# EAGLE design BMS_Schematic (EAGLE 9.7.0)
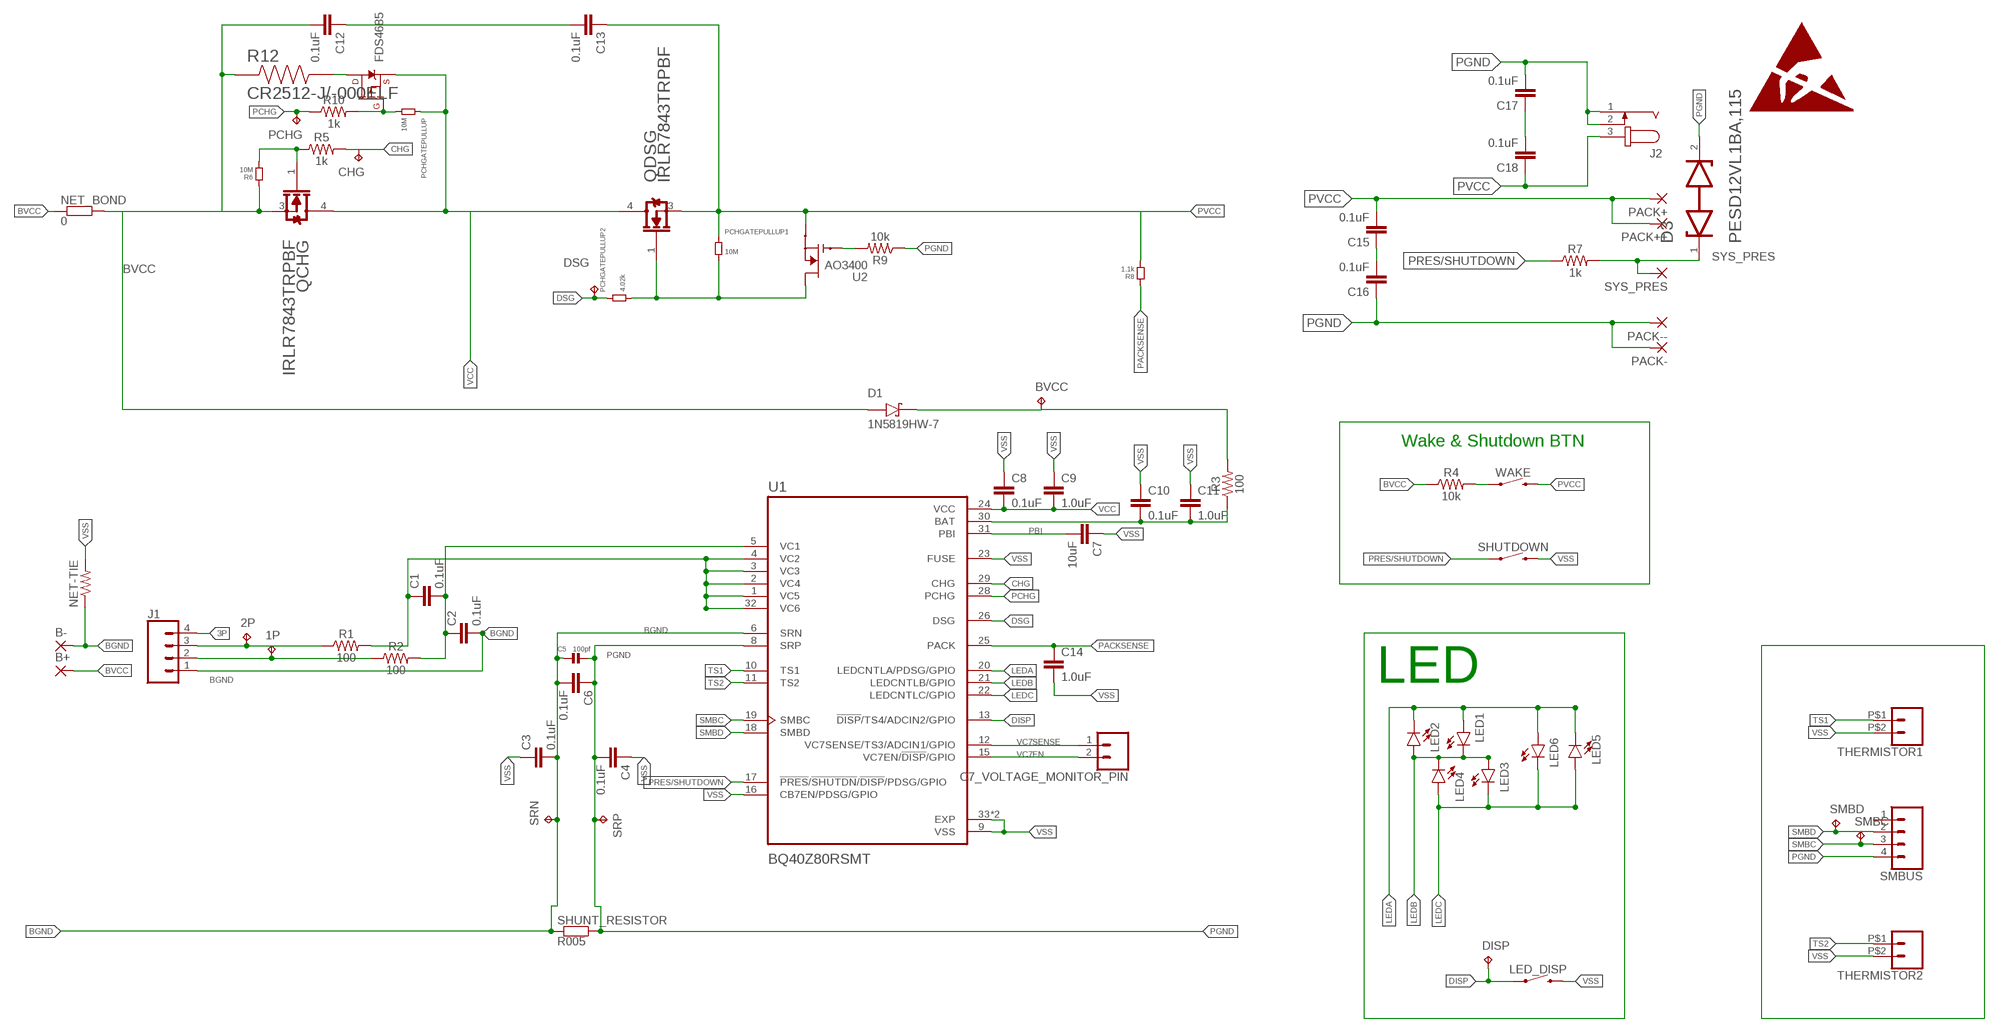
[diagram p0: schematic, sheet 1]

## Parts
1P  TPTP10R  [TP10R]
2P  TPTP10R  [TP10R]
B+  WIREPADSMD5-2,5  [5-2,5]
B-  WIREPADSMD5-2,5  [5-2,5]
BVCC  TPTP10R  [TP10R]
C1  0.1uF  0.1UF-0603-25V-5%  [0603]
C2  0.1uF  0.1UF-0603-25V-5%  [0603]
C3  0.1uF  0.1UF-0603-25V-5%  [0603]
C4  0.1uF  0.1UF-0603-25V-5%  [0603]
C5  100pf  CAPACITOR.0805  [0805]
C6  0.1uF  0.1UF-0603-25V-5%  [0603]
C7  10uF  10UF-0603-6.3V-20%  [0603]
C7_VOLTAGE_MONITOR_PIN  CONN_02  [1X02]
C8  0.1uF  0.1UF-0603-25V-(+80/-20%)  [0603]
C9  1.0uF  1.0UF-0603-16V-10%-X7R  [0603]
C10  0.1uF  0.1UF-0603-25V-(+80/-20%)  [0603]
C11  1.0uF  1.0UF-0603-16V-10%-X7R  [0603]
C12  0.1uF  0.1UF-0603-25V-(+80/-20%)  [0603]
C13  0.1uF  0.1UF-0603-25V-(+80/-20%)  [0603]
C14  1.0uF  1.0UF-0603-16V-10%-X7R  [0603]
C15  0.1uF  0.1UF-0603-25V-(+80/-20%)  [0603]
C16  0.1uF  0.1UF-0603-25V-(+80/-20%)  [0603]
C17  0.1uF  0.1UF-0603-25V-(+80/-20%)  [0603]
C18  0.1uF  0.1UF-0603-25V-(+80/-20%)  [0603]
CHG  TPTP10R  [TP10R]
D1  1N5819HW-7  [SOD3715X145N]
D3  NEXPERIA_PESD12VL1BA,115NEXPERIA_PESD12VL1BA,115_0_0  [NEXPERIA_PESD12VL1BA,115_0]
DISP  TPTP10R  [TP10R]
DSG  TPTP10R  [TP10R]
J1  CONN_04JST-PTH  [JST-4-PTH]
J2  JACK-PLUG0  [SPC4077]
LED1  GREEN  LED-GREEN0603  [LED-0603]
LED2  GREEN  LED-GREEN0603  [LED-0603]
LED3  GREEN  LED-GREEN0603  [LED-0603]
LED4  GREEN  LED-GREEN0603  [LED-0603]
LED5  GREEN  LED-GREEN0603  [LED-0603]
LED6  GREEN  LED-GREEN0603  [LED-0603]
LED_DISP  MOMENTARY-SWITCH-SPST-SMD-6.0X3.5MM  [TACTILE_SWITCH_SMD_6.0X3.5MM]
NET-TIE  0  0OHM-0402T-1/10W  [0402-TIGHT]
NET_BOND  0  BVS  [BVS]
PACK+  WIREPADSMD5-2,5  [5-2,5]
PACK++  WIREPADSMD5-2,5  [5-2,5]
PACK-  WIREPADSMD5-2,5  [5-2,5]
PACK--  WIREPADSMD5-2,5  [5-2,5]
PCHG  TPTP10R  [TP10R]
PCHGATEPULLUP  10M  RESISTOR.0805  [0805]
PCHGATEPULLUP1  10M  RESISTOR.0805  [0805]
PCHGATEPULLUP2  4.02k  RESISTOR.0805  [0805]
QCHG  INFINEON_IRLR7843TRPBFINFINEON_IRLR7843TRPBF_0_0  [INFINEON_IRLR7843TRPBF_0]
QDSG  INFINEON_IRLR7843TRPBFINFINEON_IRLR7843TRPBF_0_0  [INFINEON_IRLR7843TRPBF_0]
R1  100  100OHM-0603-1/10W-1%  [0603]
R2  100  100OHM-0603-1/10W-1%  [0603]
R3  100  100OHM-0603-1/10W-1%  [0603]
R4  10k  10KOHM-0603-1/10W-1%  [0603]
R5  1k  1KOHM-0603-1/10W-1%  [0603]
R6  10M  RESISTOR.0805  [0805]
R7  1k  1KOHM-0603-1/10W-1%  [0603]
R8  1.1k  RESISTOR.0805  [0805]
R9  10k  10KOHM-0603-1/10W-1%  [0603]
R10  1k  1KOHM-0603-1/10W-1%  [0603]
R12  CR2512-J/-000ELF  [RESC6331X75N]
SHUNT_RESISTOR  R005  BVS  [BVS]
SHUTDOWN  MOMENTARY-SWITCH-SPST-SMD-6.0X3.5MM  [TACTILE_SWITCH_SMD_6.0X3.5MM]
SMBC  TPTP10R  [TP10R]
SMBD  TPTP10R  [TP10R]
SMBUS  CONN_04JST-SMD-LOCKING  [JST-4-SMD-1.25MM-LOCKING]
SRN  TPTP10R  [TP10R]
SRP  TPTP10R  [TP10R]
SYS_PRES  SMD2  [SMD1,27-2,54]
THERMISTOR1  SOLDER_PAD_2  [SOLDER_PAD_2]
THERMISTOR2  SOLDER_PAD_2  [SOLDER_PAD_2]
U1  BQ40Z80RSMT  [QFN40P400X400X100-33N]
U2  AO3400  [SOT23]
U$2  FDS4685  [SOIC127P600X150-8N]
WAKE  MOMENTARY-SWITCH-SPST-SMD-6.0X3.5MM  [TACTILE_SWITCH_SMD_6.0X3.5MM]

## Nets
1P: C1.2 C2.1 R2.2 U1.5(VC1)
2P: C1.1 R1.2 U1.1(VC5) U1.2(VC4) U1.3(VC3) U1.4(VC2) U1.32(VC6)
3P: J1.4
BAT: C10.2 C11.2 R3.1 U1.30(BAT)
BGND: B-.1(P) C2.2 C3.2 C5.1 C6.2 J1.1 NET-TIE.1 SHUNT_RESISTOR.2 SRN.TP U1.6(SRN)
BVCC: B+.1(P) C12.2 D1.A NET_BOND.1 NET_BOND.2 QCHG.3(SOURCE) R4.1 R6.1 R12.1
CHG: CHG.TP R5.2 U1.29(CHG)
DISP: DISP.TP LED_DISP.1 U1.13(!DISP!/TS4/ADCIN2/GPIO)
DSG: DSG.TP PCHGATEPULLUP2.1 U1.26(DSG)
LEDA: LED1.A LED2.C LED5.C LED6.A U1.20(LEDCNTLA/PDSG/GPIO)
LEDB: LED1.C LED2.A LED3.A LED4.C U1.21(LEDCNTLB/GPIO)
LEDC: LED3.C LED4.A LED5.A LED6.C U1.22(LEDCNTLC/GPIO)
N$3: R9.2 U2.1(G)
N$4: 2P.TP J1.3 R1.1
N$5: 1P.TP J1.2 R2.1
N$6: C12.1 C13.2
N$7: BVCC.TP D1.C(K) R3.2
N$8: R12.2 U$2.5(D) U$2.6(D) U$2.7(D) U$2.8(D)
N$9: PCHGATEPULLUP.2 R10.2 U$2.4(G)
N$10: QCHG.1(GATE) R5.1 R6.2
N$11: PCHGATEPULLUP1.2 PCHGATEPULLUP2.2 QDSG.1(GATE) U2.3(D)
N$13: R4.2 WAKE.1
N$14: C15.1 C16.2
N$18: C17.1 C18.2
PACKSENSE: C14.1 R8.1 U1.25(PACK)
PBI: C7.2 U1.31(PBI)
PCHG: PCHG.TP R10.1 U1.28(PCHG)
PGND: C4.2 C5.2 C6.1 C16.1 C17.2 D3.2(CATHODE_2) J2.1 J2.2 PACK--.1(P) PACK-.1(P) R9.1 SHUNT_RESISTOR.1 SMBUS.4 SRP.TP U1.8(SRP)
PRES/SHUTDOWN: R7.1 SHUTDOWN.1 U1.17(!PRES!/!SHUTDN!/!DISP!/PDSG/GPIO)
PVCC: C13.1 C15.2 C18.1 J2.3 PACK++.1(P) PACK+.1(P) PCHGATEPULLUP1.1 QDSG.3(SOURCE) R8.2 U2.2(S) WAKE.2
SMBC: SMBC.TP SMBUS.3 U1.19(SMBC)
SMBD: SMBD.TP SMBUS.2 U1.18(SMBD)
SYS_PRES: D3.1(CATHODE_1) R7.2 SYS_PRES.1(P)
TS1: THERMISTOR1.P$1 U1.10(TS1)
TS2: THERMISTOR2.P$1 U1.11(TS2)
VC7EN: C7_VOLTAGE_MONITOR_PIN.2 U1.15(VC7EN/!DISP!/GPIO)
VC7SENSE: C7_VOLTAGE_MONITOR_PIN.1 U1.12(VC7SENSE/TS3/ADCIN1/GPIO)
VCC: C8.2 C9.2 PCHGATEPULLUP.1 QCHG.4(DRAIN) QDSG.4(DRAIN) U1.24(VCC) U$2.1(S) U$2.2(S) U$2.3(S)
VSS: C3.1 C4.1 C7.1 C8.1 C9.1 C10.1 C11.1 C14.2 LED_DISP.2 NET-TIE.2 SHUTDOWN.2 THERMISTOR1.P$2 THERMISTOR2.P$2 U1.9(VSS) U1.16(CB7EN/PDSG/GPIO) U1.23(FUSE) U1.33(EXP) U1.33_1(EXP)
Unconnected: SMBUS.1

## Notes on the sheet
- Wake & Shutdown BTN
- LED

## Library data of the parts
1P 2P BVCC CHG DISP DSG PCHG SMBC SMBD SRN SRP = testpad:TP: Test pad
B+ B- PACK+ PACK++ PACK- PACK-- = wirepad:WIREPAD: Wire PAD connect wire on PCB
C1-C4 C6 = SparkFun-Capacitors:0.1UF: 0.1µF ceramic capacitors A capacitor is a passive two-terminal electrical component used to store electrical energy temporarily in an electric field.; PROD_ID: CAP-08604
C5 = standardparts:CAPACITOR
C7 = SparkFun-Capacitors:10UF: 10.0µF ceramic capacitors A capacitor is a passive two-terminal electrical component used to store electrical energy temporarily in an electric field.; PROD_ID: CAP-11015
C7_VOLTAGE_MONITOR_PIN = SparkFun-Connectors:CONN_02: Multi connection point. Often used as Generic Header-pin footprint for 0.1 inch spaced/style header connections On any of the 0.1 inch spaced packages, you can populate with these: Break Away Headers - Straight <https://www.sparkfun.com/products/116> (PRT-00116) Break Away Male Headers - Right Angle <https://www.sparkfun.com/products/553> (PRT-00553) Female Headers <https://www.sparkfun.com/products/115> (PRT-00115) Break Away Headers - Machine Pin <https://www.sparkfun.com/products/117> (PRT-00117) Break Away Female Headers - Swiss Machine Pin <https://www.sparkfun.com/products/743> (PRT-00743) For SCREWTERMINALS and SPRING TERMINALS visit here: Screw Terimnals on SparkFun.com <https://www.sparkfun.com/search/results?term=Screw+Terminals> (5mm/3.5mm/2.54mm spacing) This device is also useful as a general connection point to wire up your design to another part of your project. Our various solder wires solder well into these plated through hole pads. Hook-Up Wire - Assortment (Stranded, 22 AWG) <https://www.sparkfun.com/products/11375> (PRT-11375) Hook-Up Wire - Assortment (Solid Core, 22 AWG) <https://www.sparkfun.com/products/11367> (PRT-11367) View the entire wire category on our website here <https://www.sparkfun.com/categories/141> Special notes: Molex polarized connector foot print use with: PRT-08233 with associated crimp pins and housings. 2.54_SCREWTERM for use with PRT-10571. 3.5mm Screw Terminal footprints for PRT-08084 5mm Screw Terminal footprints for use with PRT-08432
C8 C10 C12 C13 C15-C18 = SparkFun-Capacitors:0.1UF: 0.1µF ceramic capacitors A capacitor is a passive two-terminal electrical component used to store electrical energy temporarily in an electric field.; PROD_ID: CAP-00810
C9 C11 C14 = SparkFun-Capacitors:1.0UF: 1µF ceramic capacitors A capacitor is a passive two-terminal electrical component used to store electrical energy temporarily in an electric field.; PROD_ID: CAP-13930
D1 = 1N5819HW-7.lbr.lbr:1N5819HW-7: 1N5819HW Series 40 V 1 A Surface Mount Schottky Barrier Rectifier - SOD-123 Check availability <https://pricing.snapeda.com/parts/1N5819HW-7/Diodes%20Inc./view-part?ref=eda>; AVAILABILITY: In Stock; DESCRIPTION: Diode Schottky 40 V 1A Surface Mount SOD-123; MF: Diodes Inc.; MP: 1N5819HW-7; PACKAGE: SOD-123 Fairchild Semiconductor; PRICE: None; PURCHASE-URL: https://pricing.snapeda.com/search/part/1N5819HW-7/?ref=eda
D3 = Nexperia - PESD12VL1BA,115:NEXPERIA_PESD12VL1BA,115: Low capacitance bidirectional ESD protection diodes in SOD323; AMBIENT_TEMPERATURE_RANGE_HIGH: +150°C; AMBIENT_TEMPERATURE_RANGE_LOW: -65°C; BREAKDOWN_VOLTAGE: 15.9V; CENTROID_NOT_SPECIFIED: No; CLAMPING_VOLTAGE: 37V; DATASHEET: https://assets.nexperia.com/documents/data-sheet/PESDXL1BA_SER.pdf; DEVICE_CLASS_L1: Circuit Protection; DEVICE_CLASS_L2: TVS Diodes; DEVICE_CLASS_L3: unset; DIGIKEY_DESCRIPTION: DIODE TVS DIODE 12V 37V SOD323; DIGIKEY_PART_NUMBER: 1727-3808-1-ND; FOOTPRINT_URL: https://assets.nexperia.com/documents/outline-drawing/SOD323.pdf; HEIGHT: 1.1mm; LEAD_FREE: yes; MAX_JUNCTION_TEMP: +150°C; MF: Nexperia; MFG_PACKAGE_IDENT: SOD323; MFG_PACKAGE_IDENT_DATE: 04/2018; MFG_PACKAGE_IDENT_REV: 0; MOUSER_DESCRIPTION: PESDxL1BA series - Low capacitance bidirectional ESD protection diodes in SOD323; MOUSER_PART_NUMBER: 771-PESD12VL1BA-T/R; MPN: PESD12VL1BA,115; PACKAGE: SOD323; PEAK_PULSE_CURRENT: 5A; PREFIX: D; REVERSE_STANDOFF_VOLTAGE: 12V; ROHS: yes; STANDOFF_HEIGHT: 0mm; VERIFICATION_VERSION: 0.0.0.1
J1 = SparkFun-Connectors:CONN_04: Multi connection point. Often used as Generic Header-pin footprint for 0.1 inch spaced/style header connections On any of the 0.1 inch spaced packages, you can populate with these: Break Away Headers - Straight <https://www.sparkfun.com/products/116> (PRT-00116) Break Away Male Headers - Right Angle <https://www.sparkfun.com/products/553> (PRT-00553) Female Headers <https://www.sparkfun.com/products/115> (PRT-00115) Break Away Headers - Machine Pin <https://www.sparkfun.com/products/117> (PRT-00117) Break Away Female Headers - Swiss Machine Pin <https://www.sparkfun.com/products/743> (PRT-00743) For SCREWTERMINALS and SPRING TERMINALS visit here: Screw Terimnals on SparkFun.com <https://www.sparkfun.com/search/results?term=Screw+Terminals> (5mm/3.5mm/2.54mm spacing) This device is also useful as a general connection point to wire up your design to another part of your project. Our various solder wires solder well into these plated through hole pads. Hook-Up Wire - Assortment (Stranded, 22 AWG) <https://www.sparkfun.com/products/11375> (PRT-11375) Hook-Up Wire - Assortment (Solid Core, 22 AWG) <https://www.sparkfun.com/products/11367> (PRT-11367) View the entire wire category on our website here <https://www.sparkfun.com/categories/141> Special notes: Molex polarized connector foot print use with SKU : PRT-08231 with associated crimp pins and housings. 1MM SMD Version SKU: PRT-10208; PROD_ID: WIRE-13531; SF_ID: PRT-09916
J2 = con-jack:JACK-PLUG: DC POWER JACK Power Jack, DC, Right Angle, Through Hole, Rated 5A at 16VDC, PC Terminals Distributor: Farnell (www.Farnell.de) Drawing: 84N1161.pdf / 84N1162.pdf Manufacturer: SPC Technology (www.spctechnology.com) Type: SPC4077 / SPC 4078; OC_FARNELL: unknown; OC_NEWARK: unknown
LED1-LED6 = SparkFun-LED:LED-GREEN: Green SMD LED Used in manufacturing of various products at SparkFun Packages: 0603 - SMD 0603 package [Product Link] <http://www.futureelectronics.com/en/technologies/semiconductors/optoelectronics/leds/Pages/9894312-LTST-C190GKT.aspx?CrossPart=HSMG-C190&IM=0> LilyPad 1206 - SMD1206 LilyPad package [Product Link] <http://www.futureelectronics.com/en/Technologies/Product.aspx?ProductID=IN150NGHARVATEKCORPORATION2049943&IM=0> 1206 - SMD1206 package [Product Link] <http://www.futureelectronics.com/en/technologies/semiconductors/optoelectronics/leds/Pages/8315665-LTST-C150KGKT.aspx?IM=0> 1206 Bottom Mount -SMD 1206 Bottom Mount [Product Link] <http://www.digikey.com/product-detail/en/lite-on-inc/LTST-C230KGKT/160-1456-1-ND/386854> SparkFun Products: Pro Mini 328 -5V <https://www.sparkfun.com/products/821> RedBoard <https://www.sparkfun.com/products/12757> MP3 Trigger <https://www.sparkfun.com/products/13720> Makey Makey <https://www.sparkfun.com/products/11076>; PROD_ID: DIO-00821
LED_DISP SHUTDOWN WAKE = SparkFun-Switches:MOMENTARY-SWITCH-SPST: Momentary Switch (Pushbutton) - SPST Normally-open (NO) SPST momentary switches (buttons, pushbuttons). Variants PTH-12MM - 12mm square, through-hole Momentary Pushbutton Switch - 12mm Square <https://www.sparkfun.com/products/9190> (COM-09190) PTH-6.0MM, PTH-6.0MM-KIT - 6.0mm square, through-hole Mini Pushbutton Switch <https://www.sparkfun.com/products/97> (COM-00097) KIT package intended for soldering kit's - only one side of pads' copper is exposed. PTH-RIGHT-ANGLE-KIT - Right-angle, through-hole Right Angle Tactile Button <https://www.sparkfun.com/products/10791> - Used on SparkFun BigTime Watch Kit <https://www.sparkfun.com/products/11734> SMD-12MM - 12mm square, surface-mount Tactile Button - SMD (12mm) <https://www.sparkfun.com/products/12993> (COM-12993) Used on SparkFun PicoBoard <https://www.sparkfun.com/products/11888> SMD-4.5MM - 4.5mm Square Trackball Switch Used on SparkFun Blackberry Trackballer Breakout <https://www.sparkfun.com/products/13169> SMD-4.6MMX2.8MM - 4.60mm x 2.80mm, surface mount Used on SparkFun Pro Micro - RP2040 <https://www.sparkfun.com/products/17717> SMD-5.2MM, SMD-5.2-REDUNDANT - 5.2mm square, surface-mount Mini Pushbutton Switch - SMD <https://www.sparkfun.com/products/8720> (COM-08720) Used on Arduino Pro Mini <https://www.sparkfun.com/products/11114> REDUNDANT package connects both switch circuits together SMD-6.0X3.5MM - 6.0 x 3.5mm, surface mount Momentary Reset Switch SMD <https://www.sparkfun.com/products/8229> (COM-08229) SMD-6.2MM-TALL - 6.2mm square, surface mount Tactile Button - SMD (6mm) <https://www.sparkfun.com/products/12992> Used on SparkFun Digital Sandbox <https://www.sparkfun.com/products/12651> SMD-RIGHT-ANGLE - Right-angle, surface mount Used on SparkFun Block for Intel® Edison - Arduino <https://www.sparkfun.com/products/13036>; PROD_ID: SWCH-14278; SF_SKU: COM-08229
NET-TIE = SparkFun-Resistors:0OHM: 0Ω resistor A resistor is a passive two-terminal electrical component that implements electrical resistance as a circuit element. Resistors act to reduce current flow, and, at the same time, act to lower voltage levels within circuits. - Wikipedia; PROD_ID: RES-14244
NET_BOND SHUNT_RESISTOR = resistor-shunt.lbr.lbr:BVS: SMD SHUNT RESISTOR; OC_FARNELL: unknown; OC_NEWARK: unknown
PCHGATEPULLUP PCHGATEPULLUP1 PCHGATEPULLUP2 R6 R8 = standardparts:RESISTOR
QCHG QDSG = Infineon - IRLR7843TRPBF:INFINEON_IRLR7843TRPBF: N-Channel 30V 161A (Tc) 140W (Tc) Surface Mount D-Pak; AUTOMOTIVE: No; CENTROID_NOT_SPECIFIED: Yes; CONTINUOUS_DRAIN_CURRENT: 161A; DATASHEET: https://www.infineon.com/dgdl/irlr7843pbf.pdf?fileId=5546d462533600a40153566de53526d8; DEPLETION_MODE: False; DEVICE_CLASS_L1: Discrete Semiconductors; DEVICE_CLASS_L2: Transistors; DEVICE_CLASS_L3: MOSFETs; DIGIKEY_DESCRIPTION: MOSFET N-CH 30V 161A DPAK; DIGIKEY_PART_NUMBER: IRLR7843PBFCT-ND; DRAIN_TO_SOURCE_BREAKDOWN_VOLTAGE: 30V; DRAIN_TO_SOURCE_RESISTANCE: 3.2mΩ; DRAIN_TO_SOURCE_VOLTAGE: 30V; FOOTPRINT_URL: https://www.infineon.com/cms/en/product/packages/PG-TO252/PG-TO252-3-901/; FOOTPRINT_VARIANT_NAME_0: Recommended_Land_Pattern; GATE_CHARGE_AT_VGS: 34nC @ 4.5V; GATE_TO_SOURCE_VOLTAGE: 20V; HEIGHT: 2.52mm; INPUT_CAPACITACE_AT_VDS: 4380pF @ 15V; LEAD_FREE: Yes; MAX_FORWARD_DIODE_VOLTAGE: 1V; MAX_JUNCTION_TEMP: +175°C; MF: Infineon; MFG_PACKAGE_IDENT: PG-TO252-3; MFG_PACKAGE_IDENT_COMPONENT_ID: d9d1000c4571b64f; MFG_PACKAGE_IDENT_DATE: 0; MFG_PACKAGE_IDENT_REV: 901; MOUSER_PART_NUMBER: 942-IRLR7843TRPBF; MPN: IRLR7843TRPBF; NUMBER_OF_CHANNELS: 1; NUMBER_OF_N_CHANNELS: 1; PACKAGE: TO252-3; POWER_DISSIPATION: 140W; PREFIX: Q; PULSE_DRAIN_CURRENT: 620A; REVERSE_RECOVERY_CHARGE: 36nC; REVERSE_RECOVERY_TIME: 39ns; ROHS: Yes; RTHJA_MAX: 50°C/W; TEMPERATURE_RANGE_HIGH: +175°C; TEMPERATURE_RANGE_LOW: -55°C; THRESHOLD_VGS_MAX: 2.3V; THRESHOLD_VGS_MIN: 1.4V; TURN_OFF_DELAY_TIME: 34ns; TURN_ON_DELAY_TIME: 25ns; VERIFICATION_VERSION: 0.0.0.3
R1-R3 = SparkFun-Resistors:100OHM: 100Ω resistor A resistor is a passive two-terminal electrical component that implements electrical resistance as a circuit element. Resistors act to reduce current flow, and, at the same time, act to lower voltage levels within circuits. - Wikipedia; PROD_ID: RES-07863
R4 R9 = SparkFun-Resistors:10KOHM: 10kΩ resistor A resistor is a passive two-terminal electrical component that implements electrical resistance as a circuit element. Resistors act to reduce current flow, and, at the same time, act to lower voltage levels within circuits. - Wikipedia; PROD_ID: RES-00824
R5 R7 R10 = SparkFun-Resistors:1KOHM: 1kΩ resistor A resistor is a passive two-terminal electrical component that implements electrical resistance as a circuit element. Resistors act to reduce current flow, and, at the same time, act to lower voltage levels within circuits. - Wikipedia; PROD_ID: RES-07856
R12 = CR2512-J_-000ELF.lbr.lbr:CR2512-J/-000ELF: RES, THICK FILM, 0R, 5%, 1W, 2512 Check availability <https://pricing.snapeda.com/parts/CR2512-J/-000ELF/Bourns/view-part?ref=eda>; AVAILABILITY: In Stock; DESCRIPTION: 0 Ohms Jumper 1W Chip Resistor 2512 (6432 Metric) - Thick Film; MF: Bourns; MP: CR2512-J/-000ELF; PACKAGE: 6331 Bourns; PRICE: None; PURCHASE-URL: https://pricing.snapeda.com/search?q=CR2512-J/-000ELF&ref=eda
SMBUS = SparkFun-Connectors:CONN_04: Multi connection point. Often used as Generic Header-pin footprint for 0.1 inch spaced/style header connections On any of the 0.1 inch spaced packages, you can populate with these: Break Away Headers - Straight <https://www.sparkfun.com/products/116> (PRT-00116) Break Away Male Headers - Right Angle <https://www.sparkfun.com/products/553> (PRT-00553) Female Headers <https://www.sparkfun.com/products/115> (PRT-00115) Break Away Headers - Machine Pin <https://www.sparkfun.com/products/117> (PRT-00117) Break Away Female Headers - Swiss Machine Pin <https://www.sparkfun.com/products/743> (PRT-00743) For SCREWTERMINALS and SPRING TERMINALS visit here: Screw Terimnals on SparkFun.com <https://www.sparkfun.com/search/results?term=Screw+Terminals> (5mm/3.5mm/2.54mm spacing) This device is also useful as a general connection point to wire up your design to another part of your project. Our various solder wires solder well into these plated through hole pads. Hook-Up Wire - Assortment (Stranded, 22 AWG) <https://www.sparkfun.com/products/11375> (PRT-11375) Hook-Up Wire - Assortment (Solid Core, 22 AWG) <https://www.sparkfun.com/products/11367> (PRT-11367) View the entire wire category on our website here <https://www.sparkfun.com/categories/141> Special notes: Molex polarized connector foot print use with SKU : PRT-08231 with associated crimp pins and housings. 1MM SMD Version SKU: PRT-10208; PROD_ID: CONN-15303
SYS_PRES = wirepad:SMD2: SMD PAD
THERMISTOR1 THERMISTOR2 = SparkFun-Connectors:SOLDER_PAD_2: Solder Pad for LuMini Rings
U1 = BQ40Z80:BQ40Z80RSMT: 2-Series to 7-Series Battery Pack Manager with Impedance Track Gas Gauging 32-VQFN -40 to 85 Check availability <https://pricing.snapeda.com/parts/BQ40Z80RSMT/Texas%20Instruments/view-part?ref=eda>; AVAILABILITY: In Stock; DESCRIPTION: 2-s to 6-s battery pack manager with Impedance Track&trade; gas gauging; MF: Texas Instruments; MP: BQ40Z80RSMT; PACKAGE: VQFN-32 Texas Instruments; PRICE: None; PURCHASE-URL: https://pricing.snapeda.com/search/part/BQ40Z80RSMT/?ref=eda
U2 = AO3400.lbr.lbr:AO3400: Check availability <https://pricing.snapeda.com/parts/AO3400/Alpha%20%26/view-part?ref=eda>; AVAILABILITY: In Stock; DESCRIPTION: N-Channel 30 V 5.8A (Ta) 1.4W (Ta) Surface Mount SOT-23-3; MF: Alpha &; MP: AO3400; PACKAGE: SOT-23-3 Alpha &amp; Omega Semiconductor; PRICE: None; PURCHASE-URL: https://pricing.snapeda.com/search/part/AO3400/?ref=eda
U$2 = FDS4685:FDS4685

## Board
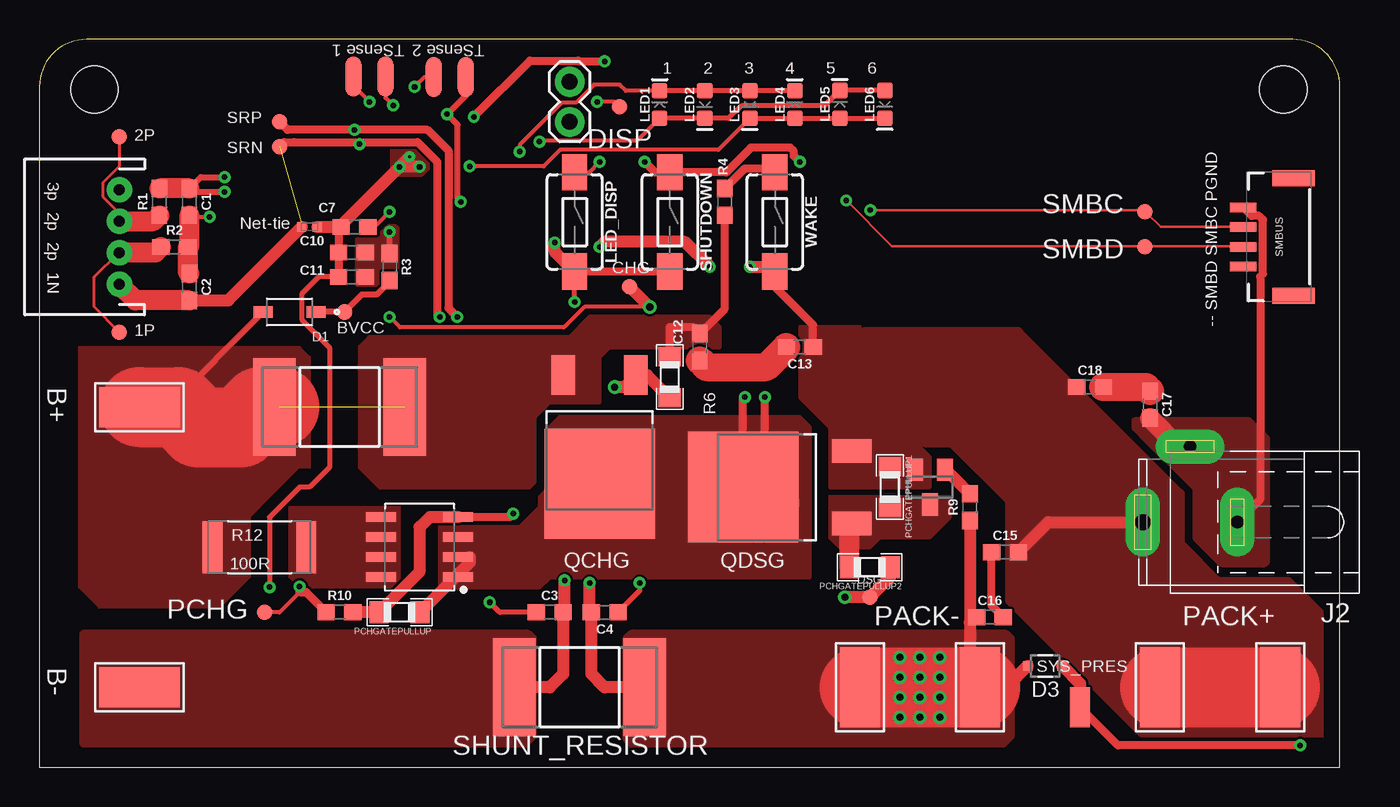
[diagram p1: board, top side]
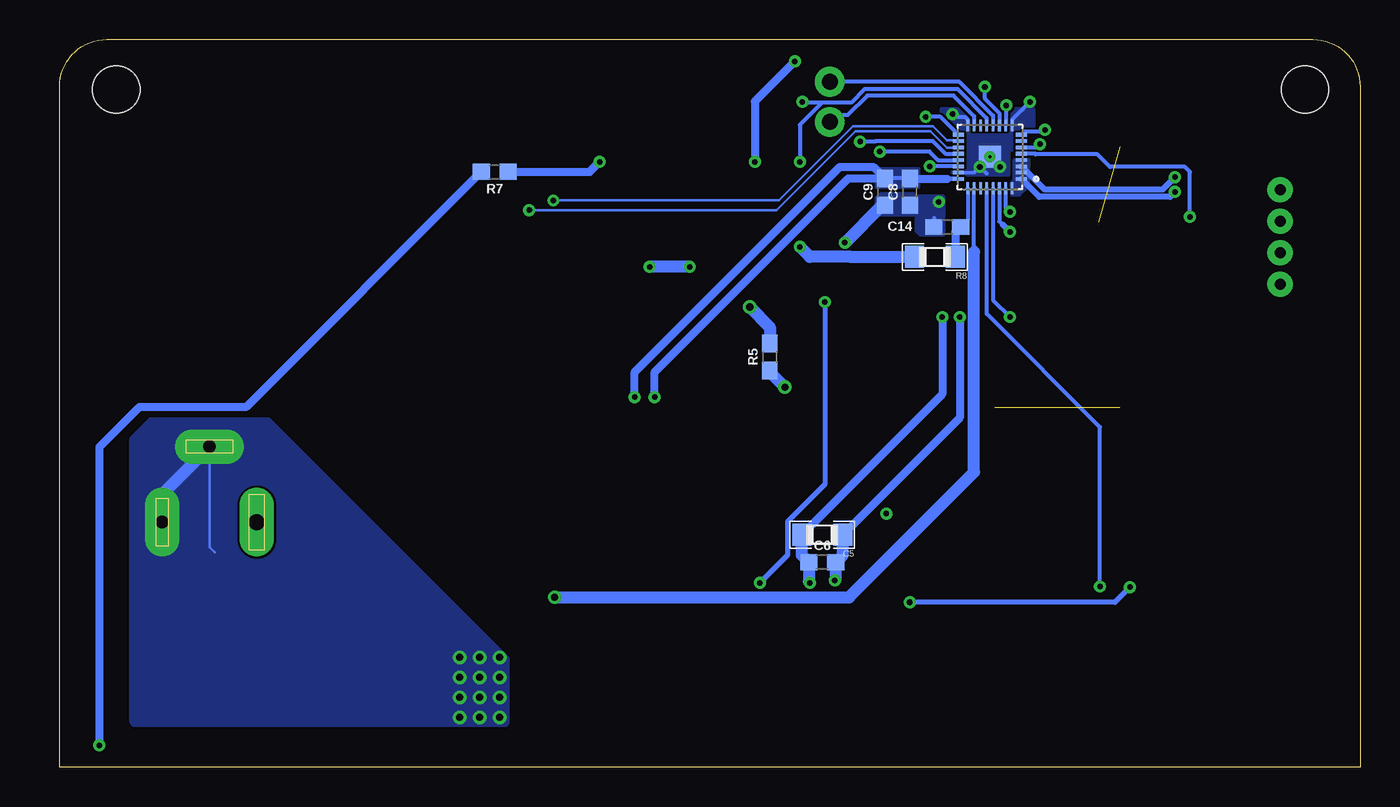
[diagram p2: board, bottom side, seen from below]

Size 82.54 x 46.19 mm. Coordinates in mm from the lower left corner, seen from the top.
Outline: 0,0 82.54,0 82.54,43.19 arc90 79.54,46.19 3,46.19 arc90 0,43.19 0,0
Copper layers (1*16): Top 0.035mm / dielectric 1.5mm / Bottom 0.035mm
Design rules "default *": minimum track width 6mil, minimum drill 0.35mm, track to track 6mil, track to pad 6mil, pad to pad 6mil, via to via 6mil, smd to smd 6mil, copper to edge 40mil, drill to drill 6mil, minimum pad ring 10mil, minimum via ring 8mil, stop-mask expansion 4mil, vias tented up to drill 3mm, thermal gap 10mil
Holes 3 mm at 3.49,43.01 78.94,43.01

### Footprints (pad centres in the part's own frame; a part is rotated, then mirrored left to right if it is on the bottom)
TP10R = smd 1 x 1: TP 0,0
5-2,5 = smd 2.54 x 5.08: 1 0,0
0603 = smd 1.1 x 1: 1 -0.85,0; 2 0.85,0
0805 = smd 1.2 x 1.4: 1 -1.3,0; 2 1.3,0
1X02 = drill 1.016 pad 1.88: 1 0,0; 2 2.54,0
SOD3715X145N = smd 1.21 x 0.73: A 1.68,0; C -1.68,0
NEXPERIA_PESD12VL1BA,115_0 = smd 0.6 x 0.6: 1 -1.1,0; 2 1.1,0 | smd 0.5 x 0.5: SMD_3 -1.1,0; SMD_4 1.1,0
JST-4-PTH = drill 0.7 pad 1.6: 1 -3,0; 2 -1,0; 3 1,0; 4 3,0
SPC4077 = drill 0.8 pad 2.184 long: 1 -3,0; 2 0,-4.8 | drill 1 pad 2.184 long: 3 3,0
LED-0603 = smd 1 x 1: A -0.877,0; C 0.877,0
TACTILE_SWITCH_SMD_6.0X3.5MM = smd 2.3 x 1.6: 1 -3.15,0; 2 3.15,0
0402-TIGHT = smd 0.6 x 0.6: 1 -0.5,0; 2 0.5,0
BVS = smd 2.7 x 6.2: 1 -4.14,0; 2 4.14,0
INFINEON_IRLR7843TRPBF_0 = smd 1.5 x 2.5: 1 -2.3,-4.575; 3 2.3,-4.575 | smd 7 x 7: 4 0,2.325
RESC6331X75N = smd 1.26 x 3.32: 1 -2.975,0; 2 2.975,0
JST-4-SMD-1.25MM-LOCKING = smd 0.6 x 1.7: 1 -1.875,3.3; 2 -0.625,3.3; 3 0.625,3.3; 4 1.875,3.3 | smd 1 x 2.7: NC1 3.725,0.1; NC2 -3.725,0.1
SMD1,27-2,54 = smd 1.27 x 2.54: 1 0,0
SOLDER_PAD_2 = smd 1.016 x 2.54: P$1 -1.016,0; P$2 1.016,0
QFN40P400X400X100-33N = smd 0.74 x 0.22: 1 -1.995,1.4; 2 -1.995,1; 3 -1.995,0.6; 4 -1.995,0.2; 5 -1.995,-0.2; 6 -1.995,-0.6; 7 -1.995,-1; 8 -1.995,-1.4; 17 1.995,-1.4; 18 1.995,-1; 19 1.995,-0.6; 20 1.995,-0.2; 21 1.995,0.2; 22 1.995,0.6; 23 1.995,1; 24 1.995,1.4 | smd 0.22 x 0.74: 9 -1.4,-1.995; 10 -1,-1.995; 11 -0.6,-1.995; 12 -0.2,-1.995; 13 0.2,-1.995; 14 0.6,-1.995; 15 1,-1.995; 16 1.4,-1.995; 25 1.4,1.995; 26 1,1.995; 27 0.6,1.995; 28 0.2,1.995; 29 -0.2,1.995; 30 -0.6,1.995; 31 -1,1.995; 32 -1.4,1.995 | smd 1.4 x 1.4: 33 0,0 | drill 0.2 pad 0.4: 33_1 0,0
SOT23 = smd 1 x 1.4: 1 -0.95,-1.1; 2 0.95,-1.1; 3 0,1.1
SOIC127P600X150-8N = smd 1.916 x 0.602: 1 -2.448,1.905; 2 -2.448,0.635; 3 -2.448,-0.635; 4 -2.448,-1.905; 5 2.448,-1.905; 6 2.448,-0.635; 7 2.448,0.635; 8 2.448,1.905

### Placement (x,y rotation side)
1P  5.08,27.62 0 top
2P  5.08,40.01 0 top
B+  6.35,22.86 90 top
B-  6.35,5.08 90 top
BVCC  19.37,28.89 0 top
C1  9.53,35.88 270 top
C2  9.53,30.48 270 top
C3  32.38,9.84 0 top
C4  35.88,9.84 180 top
C5  34.13,14.76 180 bottom
C6  34.13,13.02 0 bottom
C7  20,34.29 0 top
C7_VOLTAGE_MONITOR_PIN  33.66,43.5 270 top
C8  28.57,36.51 90 bottom
C9  30.16,36.51 90 bottom
C10  19.84,32.67 0 top
C11  19.84,31.11 0 top
C12  41.91,26.67 90 top
C13  48.26,26.67 180 top
C14  26.19,34.29 180 bottom
C15  61.28,13.65 0 top
C16  60.33,9.53 0 top
C17  70.48,23.02 270 top
C18  66.67,24.13 0 top
CHG  37.47,30.48 0 top
D1  15.88,28.89 180 top
D3  63.82,6.43 180 top
DISP  36.83,41.91 0 top
DSG  52.7,10.79 0 top
J1  5.08,33.66 90 top
J2  73.03,15.56 180 top
LED1  39.37,42.05 90 top
LED2  42.23,42.05 270 top
LED3  45.09,42.05 270 top
LED4  47.94,42.05 90 top
LED5  50.8,42.07 90 top
LED6  53.66,42.07 270 top
LED_DISP  33.97,34.61 270 top
NET-TIE  17.14,34.29 0 top
NET_BOND  19.05,22.86 180 top
PACK+  78.74,5.08 0 top
PACK++  71.12,5.08 0 top
PACK-  52.07,5.08 0 top
PACK--  59.69,5.08 0 top
PCHG  14.29,9.84 0 top
PCHGATEPULLUP  22.86,9.84 180 top
PCHGATEPULLUP1  53.98,17.78 270 top
PCHGATEPULLUP2  52.7,12.7 180 top
QCHG  35.56,20.32 180 top
QDSG  46.99,17.78 90 top
R1  7.62,35.88 90 top
R2  8.57,33.02 0 top
R3  22.23,31.75 270 top
R4  43.5,35.88 90 top
R5  37.47,26.04 90 bottom
R6  40.01,24.77 270 top
R7  54.93,37.78 180 bottom
R8  26.99,32.38 180 bottom
R9  59.05,16.51 90 top
R10  19.05,9.84 0 top
R12  13.97,13.97 0 top
SHUNT_RESISTOR  34.29,5.08 180 top
SHUTDOWN  40.01,34.61 270 top
SMBC  70.17,35.24 0 top
SMBD  70.17,33.02 0 top
SMBUS  79.69,33.66 90 top
SRN  15.24,39.37 0 top
SRP  15.24,40.96 0 top
SYS_PRES  66.04,3.81 0 top
THERMISTOR1  20.95,43.83 180 top
THERMISTOR2  26.04,43.81 0 top
U1  23.5,38.73 180 bottom
U2  56.52,17.78 180 top
U$2  24.13,13.97 180 top
WAKE  46.67,34.61 270 top

### Tracks (layer width: path | path; a pad name or v marks a point on that pad's centre or on a via)
1P  (via drill 0.35)
  Top 0.246: v10.79,34.92 9.63,34.92 C1.2
  Top 1.27: C1.2 9.53,33.12 R2.2 9.42,31.43 C2.1
  Bottom 0.246: v10.79,34.92 10.79,37.78 11.11,38.1 15.88,38.1 16.67,38.89 20.59,38.89 20.64,38.94 U1.5
2P  (via drill 0.35)
  Top 0.381: v11.75,36.51 9.74,36.51 C1.1 10.24,37.45 v11.75,37.45
  Top 1.27: C1.1 R1.2
  Bottom 0.381: U1.1 20.36,36.2 12.06,36.2 v11.75,36.51 | U1.3 20.04,36.67 12.52,36.67 v11.75,37.45
  pour Bottom (no thermals): 22.1,36.32 22.1,37.09 21.96,37.23 21.94,37.28 21.94,38.52 21.85,38.61 21.08,38.61 21.08,36.88 21.64,36.32
BAT  (via drill 0.35)
  Top 0.381: R3.1 v22.23,33.97
  Bottom 0.246: U1.30 22.89,34.64 22.7,34.45
  Bottom 0.381: 22.7,34.45 v22.23,33.97
  pour Top (no thermals): 21.81,33.51 21.73,33.44 21.64,33.4 20.26,33.4 20.26,30.73 22.61,30.73 22.61,34.19 22.17,34.19 21.84,33.87 21.84,33.6
BGND  (via drill 0.35)  (1 unrouted)
  Top 0.152: 16.61,34.59 NET-TIE.1
  Top 0.508: 20.32,39.67 16.16,39.67 16.15,39.66 15.53,39.66 SRN.TP | 20.32,39.67 23.99,39.67 25.24,38.42 25.24,28.74 v25.41,28.57 | v20.32,39.55 20.32,39.67
  Top 0.762: NET-TIE.1 11.98,29.63 C2.2 | SHUNT_RESISTOR.2 32.38,5.08 33.23,5.93 C3.2 33.34,9.95 v33.34,11.87
  Top 1.27: C2.2 6.11,29.63 J1.1
  Bottom 0.246: U1.6 20.53,39.34 v20.32,39.55
  Bottom 0.508: v25.41,28.57 25.41,22.19 C5.1
  Bottom 0.762: v33.34,11.87 33.28,11.92 C6.2 32.83,13.47 C5.1
  pour Top (no thermals): 2.79,1.52 30.85,1.52 31.34,2.01 31.34,8.15 31.01,8.48 2.79,8.48
BVCC  (1 unrouted)
  Top 0.152: 11.12,13.87 R12.1 | 23.16,22.86 NET_BOND.1
  Top 0.381: 14.04,22.86 14.3,23.12 | D1.A 8.16,22.86 B+.1
  Top 0.508: R6.1 40.01,27.94 41.49,27.94 C12.2 43.5,29.11 R4.1
  Top 5.08: B+.1 8.82,22.86 10.11,21.57 12.75,21.57 14.04,22.86 15.24,22.86
  pour Top (no thermals): 31.11,17.78 31.43,18.1 31.43,22.2 31.45,22.24 32.37,23.16 32.41,23.18 35.56,23.18 35.56,26.67 34.92,27.3 20.95,27.3 20.32,26.67 20.32,19.05 21.59,17.78
  pour Top (no thermals): 11.43,10.16 13.34,12.06 13.34,15.86 13.35,15.89 16.5,19.04 16.53,19.05 17.14,19.05 17.14,26.04 16.51,26.67 2.54,26.67 2.54,11.43 3.81,10.16
  pour Top (no thermals): 33.66,27.3 35.56,25.4 35.56,26.01 35.58,26.05 36.18,26.65 36.22,26.67 43.18,26.67 43.18,27.94 42.55,28.57 34.92,28.57
CHG  (via drill 0.35, 0.45)
  Top 0.254: v22.23,28.57 22.88,27.92 33.29,27.92 34.59,29.21 v38.73,29.21
  Top 0.762: v38.73,29.21 CHG.TP
  Bottom 0.246: U1.29 23.3,29.64
  Bottom 0.254: 23.3,29.64 v22.23,28.57
  Bottom 0.762: R5.2 37.47,27.94 v38.73,29.21
DISP  (via drill 0.35)
  Top 0.246: v35.56,38.42 34.9,37.76 LED_DISP.1 | v35.4,42.23 36.51,42.23 DISP.TP
  Bottom 0.246: U1.13 23.71,40.74 23.71,41.2 25.54,43.02 31.45,43.02 32.3,42.17 34.16,42.17 | 34.16,42.17 35.56,40.77 v35.56,38.42 | 34.16,42.17 35.35,42.17 v35.4,42.23
DSG  (via drill 0.45)
  Top 0.305: 52.86,10.95 DSG.TP
  Top 0.762: PCHGATEPULLUP2.1 54.01,12.1 52.86,10.95 | DSG.TP v51.12,10.79
  Bottom 0.246: 24.5,33.02 U1.26
  Bottom 0.305: 24.5,32.7 24.5,33.02
  Bottom 0.762: v51.12,10.79 32.43,10.79 24.5,18.73 24.5,32.7
LEDA  (via drill 0.35)
  Top 0.246: LED1.A 37.94,39.74 31.78,39.74 v31.74,39.7
  Top 0.305: LED6.A LED5.C 49.83,41.98 44.55,41.98 43.74,41.17 LED2.C LED1.A
  Bottom 0.246: U1.20 26.33,38.94 27.12,39.73 30.75,39.73 30.77,39.7 v31.74,39.7
LEDB  (via drill 0.35)
  Top 0.246: LED1.C 37.23,42.92 36.83,43.32 35.2,43.32 34.05,42.17 33.15,42.17 30.48,39.5 v30.48,39.07
  Top 0.305: LED4.C LED3.A LED2.A LED1.C
  Bottom 0.246: U1.21 26.79,38.53 27.33,39.07 v30.48,39.07
LEDC  (via drill 0.35)
  Top 0.246: LED3.C 43.1,39.18 33.06,39.18 32,38.13 v27.3,38.13
  Top 0.305: LED3.C LED4.A 50.78,41.17 LED5.A LED6.C
  Bottom 0.246: U1.22 27.27,38.13 27.28,38.13 v27.3,38.13
N$3
  Top 0.762: U2.1 57.53,18.88 R9.2
N$4
  Top 0.2: 2P.TP 5.08,38.14 4.03,37.09 4.03,36.22 5.08,35.17 J1.3
  Top 1.27: J1.3 7.25,34.66 R1.1
N$5
  Top 0.2: 1P.TP 3.49,29.21 3.49,31.11 5.03,32.66 J1.2
  Top 1.27: R2.1 7.36,32.66 J1.2
N$6
  Top 1.778: C12.1 42.33,25.4 46.14,25.4 C13.2
N$7
  Top 0.381: D1.C BVCC.TP 20.48,30 21.43,30 22.23,30.8 R3.2
N$8
  pour Top (no thermals): 16.51,11.43 22.86,11.43 22.86,16.51 15.88,16.51 15.88,12.06
N$9  (via drill 0.35)
  Top 0.508: U$2.4 29.84,15.88 v30.07,16.1
  Top 0.762: U$2.4 24.77,15.88 24.13,15.24 24.13,12.41 PCHGATEPULLUP.2 R10.2
N$10  (via drill 0.45)
  Top 0.762: R6.2 38.58,24.89 QCHG.1 37.09,24.13 v36.51,24.13
  Bottom 0.762: v36.51,24.13 37.47,25.08 R5.1
N$11
  Top 1.27: PCHGATEPULLUP2.2 51.41,15.32 QDSG.1
  pour Top (no thermals): 53.32,14.59 53.37,14.61 56.52,14.61 57.78,15.88 57.78,17.14 50.16,17.14 50.16,14.61 50.8,13.97 52.7,13.97
N$13
  Top 0.508: WAKE.1 46.43,38 44.77,38 R4.2
N$14
  Top 0.508: C16.2 60.43,10.27 C15.1
N$18
  Top 1.778: C17.1 70.22,24.13 C18.2
PACKSENSE
  Bottom 0.246: U1.25 24.89,34.74 C14.1 25.69,33.95
  Bottom 0.508: 25.69,33.95 R8.1
PBI  (via drill 0.35)
  Top 0.246: C7.2 21.27,34.29 v22.23,35.24
  Bottom 0.246: U1.31 22.5,35.51 v22.23,35.24
PCHG  (via drill 0.35)
  Top 0.246: PCHG.TP 15.24,9.84 16.51,11.11 v16.51,11.48
  Top 0.508: R10.1 16.93,11.11 16.51,11.11
  Bottom 0.239: 23.7,28.77 23.7,29.84
  Bottom 0.246: 23.7,29.84 U1.28
  Bottom 0.254: 23.7,28.77 16.51,21.59 v16.51,11.48
PGND  (via drill 0.35, 0.45)
  Top 0.508: C16.1 59.16,9.21 59.05,9.21 | SRP.TP 15.74,40.45 v20,40.45 24.63,40.45 25.96,39.13 25.96,29.14 26.19,28.9 26.19,28.89 v26.51,28.57 | SMBUS.4 76.94,34.99 77.41,34.99 77.65,34.75 77.65,31.31 77.47,31.13 77.47,17 J2.1
  Top 0.762: R9.1 59.05,9.21 59.05,5.71 PACK--.1 | 60.73,5.08 PACK--.1 | D3.2 61.36,5.08 PACK--.1 | SHUNT_RESISTOR.1 35.88,5.08 35.03,5.93 C4.2 34.92,9.95 v34.92,11.71
  Top 1.27: C17.2 72.3,20.36 J2.2
  Top 5.08: PACK-.1 PACK--.1
  Bottom 0.152: J2.2 73.03,13.97 72.71,13.65
  Bottom 0.246: U1.8 21.31,40.32 20.13,40.32 v20,40.45
  Bottom 0.508: v26.51,28.57 26.51,23.68 C5.2 | 34.92,11.75 v34.92,11.71
  Bottom 0.762: J2.2 76.52,16.86 76.52,15.24 76.34,15.24 J2.1 | 34.92,11.75 34.98,11.8 C6.1 35.43,13.47 C5.2
  other vias: 54.61,6.99 55.88,6.99 57.15,6.99 54.61,5.71 55.88,5.71 57.15,5.71 54.61,4.45 55.88,4.45 57.15,4.45 54.61,3.17 55.88,3.17 57.15,3.17
  pour Bottom (no thermals): 54.36,2.92 77.72,2.92 77.72,20.8 76.68,21.84 69.37,21.84 54.36,6.83
  pour Top (no thermals): 37.57,1.52 61.17,1.52 61.66,2.01 61.66,8.15 61.33,8.48 37.57,8.48 37.24,8.15 37.24,1.85
  pour Top (no thermals): 73.54,17.77 73.56,17.67 73.56,14.6 75.09,13.08 77.72,13.08 77.72,20.8 76.68,21.84 69.6,21.84 69.6,21.75 73.49,17.86
PRES/SHUTDOWN  (via drill 0.35)
  Top 0.508: v35.88,44.79 34.26,44.79 34.21,44.84 31.14,44.84 v27.57,41.27 | v48.26,38.42 47.88,38.8 47.88,39.08 47.64,39.31 45.15,39.31 43.59,37.76 SHUTDOWN.1 39.08,37.76 v38.42,38.42
  Bottom 0.246: U1.17 26.63,41.27 v27.57,41.27
  Bottom 0.508: v35.88,44.79 38.42,42.25 v38.42,38.42 | R7.1 48.9,37.78 v48.26,38.42
PVCC  (via drill 0.35)
  Top 0.508: WAKE.2 46.67,31.11 46.67,30.5 49.11,28.07 49.11,26.89
  Top 0.762: C13.1 49.11,26.89 | v45.09,31.75 46.04,31.75 46.67,31.11 | v42.55,31.75 40.96,33.34 35.88,33.34 v35.56,33.02 | C15.2 64.03,15.56 J2.3
  Top 5.08: PACK++.1 PACK+.1
  Bottom 0.762: v42.55,31.75 v45.09,31.75 | R8.2 32.32,32.38 34.92,32.38 v35.56,33.02
  pour Top (no thermals): 50.15,21.61 50.16,21.56 50.16,17.78 56.52,17.78 56.52,19.68 52.09,24.11 52.07,24.16 52.07,27.94 48.26,27.94 48.26,23.5
  pour Top (no thermals): 61.63,16.97 61.66,16.88 61.66,10.64 70.01,2.29 81.53,2.29 81.53,9.37 79.22,11.68 74.88,11.68 74.78,11.71 74.7,11.76 72.4,14.05 72.35,14.14 72.33,14.24 72.33,17.3 62.07,27.56 52.45,27.56 52.45,24.45 56.2,20.7 57.84,20.7 57.93,20.68 58.02,20.62 61.58,17.06
SMBC  (via drill 0.35)
  Top 0.152: v52.73,35.36 70.1,35.36 SMBC.TP 70.26,35.2 71.17,34.29 76.35,34.29 SMBUS.3
  Bottom 0.152: v52.73,35.36 37.03,35.36 32.03,40.36 27.26,40.36 26.21,39.32 25.6,39.32 U1.19
SMBD  (via drill 0.35)
  Top 0.152: v51.21,35.97 54.1,33.07 70.1,33.07 SMBD.TP 70.26,33.07 76.35,33.07 SMBUS.2
  Bottom 0.152: v51.21,35.97 36.88,35.97 32.18,40.67 27.11,40.67 26.21,39.78 25.6,39.78 U1.18
SYS_PRES  (via drill 0.35)
  Top 0.508: v80.01,1.4 68.45,1.4 SYS_PRES.1
  Top 0.762: D3.1 66.04,5.31 SYS_PRES.1
  Bottom 0.508: R7.2 70.7,22.86 77.47,22.86 80.01,20.32 v80.01,1.4
TS1  (via drill 0.35)
  Top 0.246: THERMISTOR1.P$1 21.97,42.48 v22.46,42
  Bottom 0.246: v22.46,42 22.5,41.96 U1.10
TS2  (via drill 0.35)
  Top 0.246: v23.81,43.18 24.45,43.81 THERMISTOR2.P$1
  Bottom 0.246: v23.81,43.18 23.81,42.43 22.89,41.51 U1.11
VC7EN
  Bottom 0.246: U1.15 24.5,41.32 25.8,42.63 31.28,42.63 32.53,41.38 33.24,41.38 C7_VOLTAGE_MONITOR_PIN.2
VC7SENSE
  Bottom 0.246: U1.12 23.3,41.35 25.45,43.5 C7_VOLTAGE_MONITOR_PIN.1
VCC  (via drill 0.35)
  Top 0.152: QDSG.4 45.72,17.78 | 33.02,15.46 QCHG.4
  Top 0.508: v44.77,23.5 44.66,23.39 QDSG.4 46.04,19.15 v46.04,23.5
  Top 0.762: PCHGATEPULLUP.1 27.3,12.99 27.3,13.34
  Top 5.08: QDSG.4 45.67,16.77
  Bottom 0.246: C9.2 28.89,37.36 C8.2
  Bottom 0.254: 28.89,37.36 U1.24 26.2,37.34 C8.2
  Bottom 0.508: C8.2 28.55,37.34 26.2,37.34 | v44.77,23.5 44.77,25.08 32.49,37.36 C9.2 30.9,38.1 33.02,38.1 46.04,25.08 v46.04,23.5
  pour Top (no thermals): 31.73,16.49 30.5,15.26 30.45,15.24 25.4,15.24 25.4,11.43 31.75,11.43 32.37,12.05 32.41,12.06 48.9,12.06 48.9,21.59 48.26,22.23 33.02,22.23 32.38,21.59 32.38,17.81 32.37,17.76 31.75,17.14 31.75,16.54
  pour Bottom (no thermals): 28.06,36.79 30.67,36.79 30.67,37.98 28.06,37.98
VSS  (via drill 0.35)
  Top 0.246: THERMISTOR1.P$2 19.94,43.24 v20.95,42.23
  Top 0.305: C11.1 17.72,31.11 16.64,30.04 16.64,28.4 18.41,26.63 18.41,19.05 17.14,17.78 16.51,17.78 14.61,15.88 v14.61,11.43 | v33.97,29.53 LED_DISP.2 | C3.1 29.21,9.84 v28.57,10.48 | v38.1,11.71 38.1,11.21 C4.1
  Top 0.381: v26.74,35.88 26.55,36.06 26.55,40.76 v25.87,41.44 27.05,42.62 THERMISTOR2.P$2
  Top 0.508: U1.33_1 23.5,38.63 C7.1 18.99,34.13 C10.1 C11.1 | SHUTDOWN.2 LED_DISP.2
  Top 0.762: v32.7,33.3 32.7,32.73 LED_DISP.2 | NET-TIE.2 C7.1 19.15,34.39 20.08,35.32 v22.86,38.1 | v24.13,38.1 v22.86,38.1 | U1.33_1 v22.86,38.1
  Bottom 0.229: U1.23 24.5,37.73
  Bottom 0.246: U1.9 22.09,41.09 21.43,41.75 v20.95,42.23 | U1.16 24.89,41.09 25.08,41.27 25.7,41.27 v25.87,41.44 | 27.04,34.87 C14.2 | 28.47,35.56 C8.1 | C9.1 32.53,33.3 v32.7,33.3 | 23.7,37.66 v24.13,38.1 24.5,37.73
  Bottom 0.305: v33.97,29.53 33.97,17.95 36.34,15.59 36.34,13.47 v38.1,11.71 | v14.61,11.43 15.56,10.48 v28.57,10.48
  Bottom 0.381: C8.1 28.36,35.88
  Bottom 0.762: C9.1 30.34,35.66 v32.7,33.3
  pour Bottom (no thermals): 28.19,35.18 30.54,35.18 30.54,36.09 30.37,36.26 28.36,36.26 28.19,36.09
  pour Bottom (no thermals): 26.48,33.78 27.89,33.78 28.13,34.02 28.13,36.14 28.05,36.23 26.48,36.23
  pour Bottom (no thermals): 22.33,39.12 22.35,39.08 22.35,37.59 25.88,37.59 26.55,38.26 26.55,41.79 20.76,41.79 20.76,39.42 21.01,39.18 22.25,39.18 22.29,39.16
  pour Top (no thermals): 22.48,37.72 24.18,37.72 24.67,38.21 24.67,39.12 22.48,39.12

### Text on the board
tNames: TSense 1 | TSense 2 | 1 2 3 4 5 6 | 3p | 2p | Net-tie | 2p | 1N | -- SMBD SMBC PGND | 100R